# Altium project RollingBallMainBoard.PrjPcb
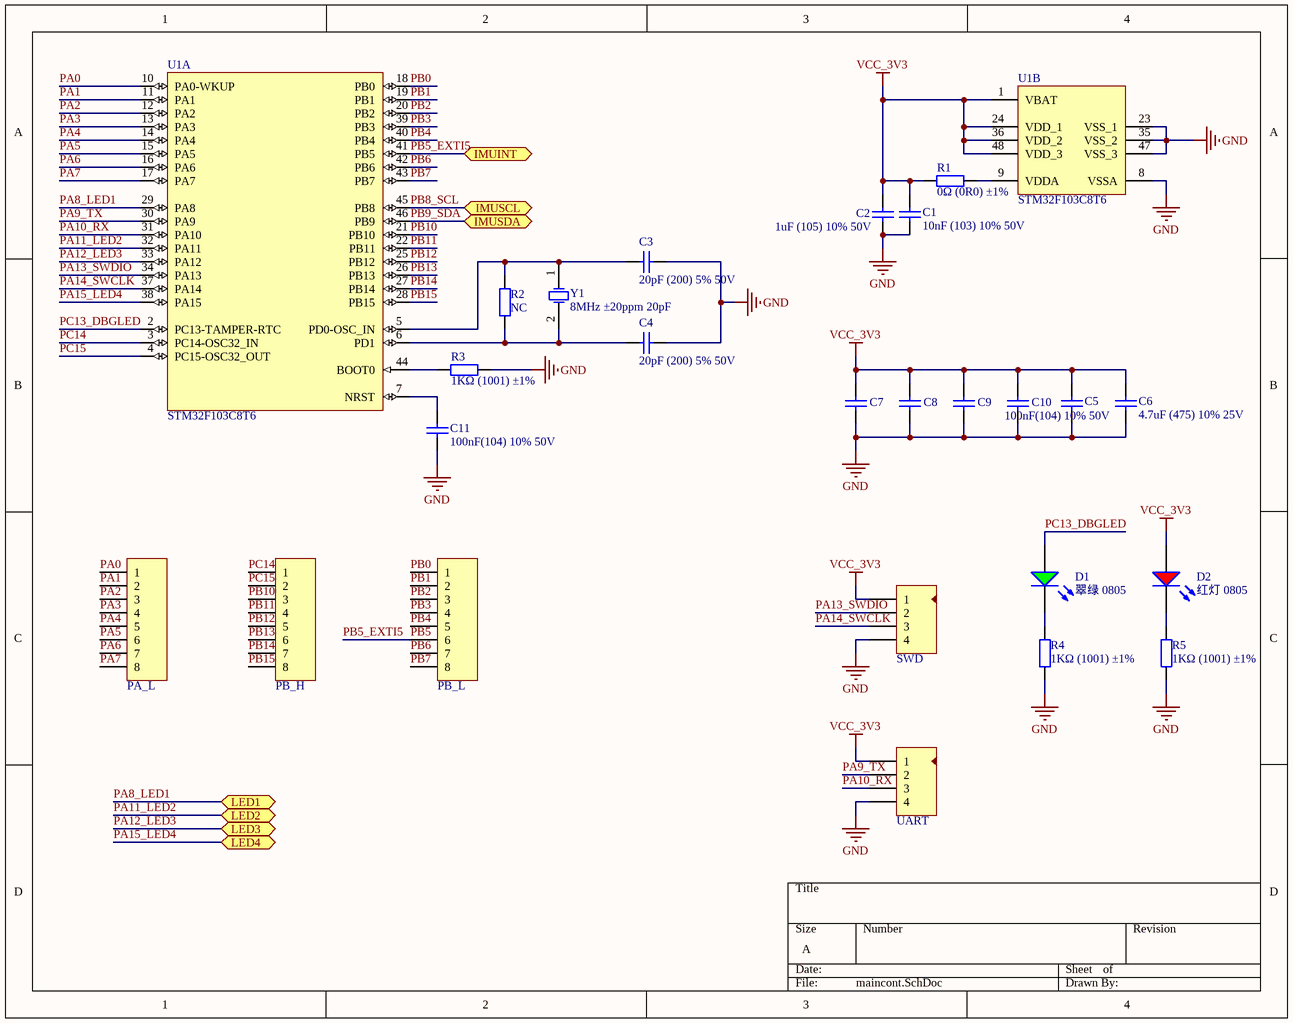
[diagram p0: maincont.SchDoc]
4 sheets, 91 parts. Net scope: flat (ports and power ports of the same name join across sheets).
Board file: RollingBall.PcbDoc
Sheets:
  maincont.SchDoc
  imu.SchDoc
  power.SchDoc
  LED.SchDoc

## Sheet maincont.SchDoc
size A

### Parts
C1  10nF (103) 10% 50V  [LC-0805_C]
C2  1uF (105) 10% 50V  [LC-0805_C]
C3  20pF (200) 5% 50V  [LC-0805_C]
C4  20pF (200) 5% 50V  [LC-0805_C]
C5  100nF(104) 10% 50V  [LC-0805_C]
C6  4.7uF (475) 10% 25V  [LC-0805_C]
C7  100nF(104) 10% 50V  [LC-0805_C]  (value not drawn)
C8  100nF(104) 10% 50V  [LC-0805_C]  (value not drawn)
C9  100nF(104) 10% 50V  [LC-0805_C]  (value not drawn)
C10  100nF(104) 10% 50V  [LC-0805_C]  (value not drawn)
C11  100nF(104) 10% 50V  [LC-0805_C]
D1  翠绿 0805  [LC-0805_LED_S1]
D2  红灯 0805  [LC-0805_LED_S1]
P1  PA_L  [HDR1X8]
P2  PB_H  [HDR1X8]
P3  PB_L  [HDR1X8]
P4  SWD  [HDR4X1-2.54]
P5  UART  [HDR4X1-2.54]
R1  0Ω (0R0) ±1%  [LC-0805_R]
R2  NC  [LC-0805_R]
R3  1KΩ (1001) ±1%  [LC-0805_R]
R4  1KΩ (1001) ±1%  [LC-0805_R]
R5  1KΩ (1001) ±1%  [LC-0805_R]
U1  STM32F103C8T6  [LC-LQFP-48_7x7x05P]  (parts A,B of 2)
Y1  8MHz ±20ppm 20pF  [LC-SMD-5032_2P]

### Ports
IMUINT, IMUSCL, IMUSDA, LED1, LED2, LED3, LED4

### Nets
GND: C1.1 C2.1 C3.2 C4.2 C5.2 C6.1 C7.2 C8.2 C9.2 C10.2 C11.1 P4.4 P5.4 R3.2 R4.1 R5.1 U1.8(VSSA) U1.23(VSS_1) U1.35(VSS_2) U1.47(VSS_3)
VCC_3V3: C1.2 C2.2 C5.1 C6.2 C7.1 C8.1 C9.1 C10.1 D2.A P4.1 P5.1 R1.2 U1.1(VBAT) U1.24(VDD_1) U1.36(VDD_2) U1.48(VDD_3)
PA0: P1.1 U1.10(PA0-WKUP)
PA1: P1.2 U1.11(PA1)
PA2: P1.3 U1.12(PA2)
PA3: P1.4 U1.13(PA3)
PA4: P1.5 U1.14(PA4)
PA5: P1.6 U1.15(PA5)
PA6: P1.7 U1.16(PA6)
PA7: P1.8 U1.17(PA7)
PA8_LED1: U1.29(PA8) ; port LED1  [project net LED_CONT1]
PA9_TX: P5.2 U1.30(PA9)
PA10_RX: P5.3 U1.31(PA10)
PA11_LED2: U1.32(PA11) ; port LED2  [project net LED_CONT2]
PA12_LED3: U1.33(PA12) ; port LED3  [project net LED_CONT3]
PA13_SWDIO: P4.2 U1.34(PA13)
PA14_SWCLK: P4.3 U1.37(PA14)
PA15_LED4: U1.38(PA15) ; port LED4  [project net LED_CONT4]
PB0: P3.1 U1.18(PB0)
PB1: P3.2 U1.19(PB1)
PB2: P3.3 U1.20(PB2)
PB3: P3.4 U1.39(PB3)
PB4: P3.5 U1.40(PB4)
PB5: P3.6 U1.41(PB5) ; port IMUINT  [also labelled PB5_EXTI5]  [project net INT]
PB6: P3.7 U1.42(PB6)
PB7: P3.8 U1.43(PB7)
PB8_SCL: U1.45(PB8) ; port IMUSCL
PB9_SDA: U1.46(PB9) ; port IMUSDA
PB10: P2.3 U1.21(PB10)
PB11: P2.4 U1.22(PB11)
PB12: P2.5 U1.25(PB12)
PB13: P2.6 U1.26(PB13)
PB14: P2.7 U1.27(PB14)
PB15: P2.8 U1.28(PB15)
PC13_DBGLED: D1.A U1.2(PC13-TAMPER-RTC)
PC14: P2.1 U1.3(PC14-OSC32_IN)
PC15: P2.2 U1.4(PC15-OSC32_OUT)
NetC3_1: C3.1 R2.1 U1.5(PD0-OSC_IN) Y1.1(OSC1)
NetC4_1: C4.1 R2.2 U1.6(PD1) Y1.2(OSC2)
NetC11_2: C11.2 U1.7(NRST)
NetD1_K: D1.K R4.2
NetD2_K: D2.K R5.2
NetR1_1: R1.1 U1.9(VDDA)
NetR3_1: R3.1 U1.44(BOOT0)

### Library data of the parts
C1 = 0805 10nF (103) 10% 50V: 贴片电容; ComponentLink1Description: 供应商链接; ComponentLink1URL: http://www.szlcsc.com/product/details_2062.html; Package: 0805; Supplier: LC; SuppliersPartNumber: C1710
C2 = 0805 1uF (105) 10% 50V: 贴片电容; ComponentLink1Description: 供应商链接; ComponentLink1URL: http://www.szlcsc.com/product/details_29074.html; Package: 0805; Supplier: LC; SuppliersPartNumber: C28323
C3 C4 = 0805 20pF (200) 5% 50V: 贴片电容; ComponentLink1Description: 供应商链接; ComponentLink1URL: http://www.szlcsc.com/product/details_2150.html; Package: 0805; Supplier: LC; SuppliersPartNumber: C1798
C5 C7-C11 = 0805 100nF(104) 10% 50V: 贴片电容; ComponentLink1Description: 供应商链接; ComponentLink1URL: http://www.szlcsc.com/product/details_50686.html; Package: 0805; Supplier: LC; SuppliersPartNumber: C49678
C6 = 0805 4.7uF (475) 10% 25V: 贴片电容; ComponentLink1Description: 供应商链接; ComponentLink1URL: http://www.szlcsc.com/product/details_2131.html; Package: 0805; Supplier: LC; SuppliersPartNumber: C1779
D1 = 0805 翠绿: 发光二极管; ComponentLink1Description: 供应商链接; ComponentLink1URL: http://www.szlcsc.com/product/details_2670.html; Package: 0805; Supplier: LC; SuppliersPartNumber: C2297
D2 = 0805 红灯: 发光二极管; ComponentLink1Description: 供应商链接; ComponentLink1URL: http://www.szlcsc.com/product/details_2668.html; Package: 0805; Supplier: LC; SuppliersPartNumber: C2295
P1-P3 = Header 8: Header, 8-Pin; LatestRevisionDate: 17-Jul-2002; LatestRevisionNote: Re-released for DXP Platform.; Publisher: Altium Limited
P4 P5 = Header 4: 接插件; LatestRevisionDate: 17-Jul-2002; LatestRevisionNote: Re-released for DXP Platform.; Publisher: Altium Limited
R1 = 0805 0Ω (0R0) 1%: 贴片电阻; ComponentLink1Description: 供应商链接; ComponentLink1URL: http://www.szlcsc.com/product/details_18165.html; Package: 0805; Supplier: LC; SuppliersPartNumber: C17477
R2 = 0805 1MΩ (1004) 1%: 贴片电阻; ComponentLink1Description: 供应商链接; ComponentLink1URL: http://www.szlcsc.com/product/details_18202.html; Package: 0805; Supplier: LC; SuppliersPartNumber: C17514
R3-R5 = 0805 1KΩ (1001) 1%: 贴片电阻; ComponentLink1Description: 供应商链接; ComponentLink1URL: http://www.szlcsc.com/product/details_18201.html; Package: 0805; Supplier: LC; SuppliersPartNumber: C17513
U1 = STM32F103C8T6: ARM; ComponentLink1Description: 供应商链接; ComponentLink1URL: http://www.szlcsc.com/product/details_9243.html; Package: LQFP-48_7x7x05P; Supplier: LC; SuppliersPartNumber: C8734
Y1 = SMD-5032_2P 8MHz 20ppm 20pF: 贴片晶振; ComponentLink1Description: 供应商链接; ComponentLink1URL: http://www.szlcsc.com/product/details_19261.html; Package: SMD-5032_2P; Supplier: LC; SuppliersPartNumber: C18560

## Sheet imu.SchDoc
size A
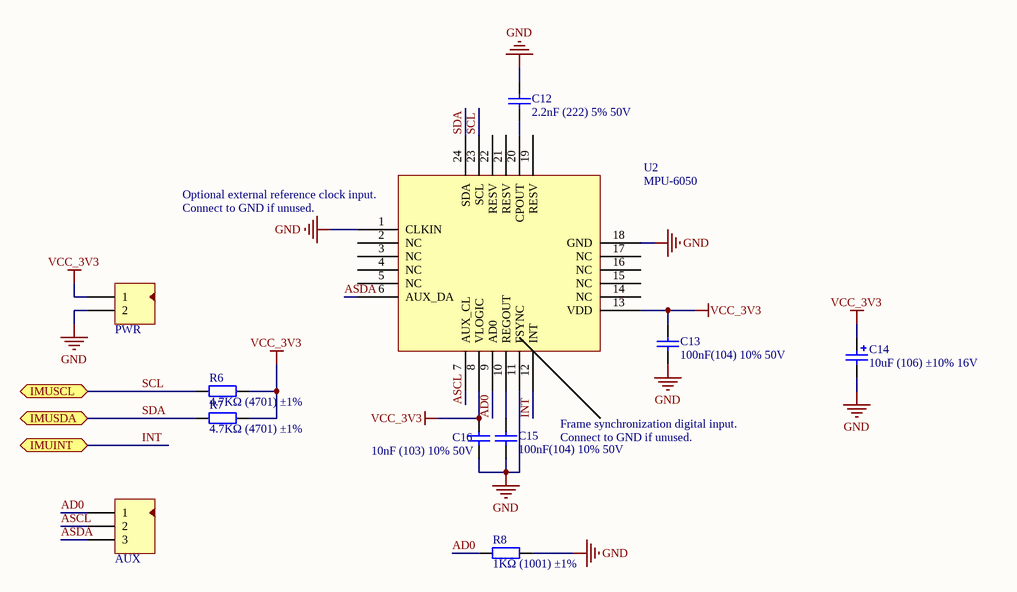
[diagram p1: imu.SchDoc]

### Parts
C12  2.2nF (222) 5% 50V  [LC-0805_C]
C13  100nF(104) 10% 50V  [LC-0805_C]
C14  10uF (106) ±10% 16V  [LC-CASE-A_3216]
C15  100nF(104) 10% 50V  [LC-0805_C]
C16  10nF (103) 10% 50V  [LC-0805_C]
P6  PWR  [HDR2X1-2.54]
P7  AUX  [HDR3X1-2.54]
R6  4.7KΩ (4701) ±1%  [LC-0805_R]
R7  4.7KΩ (4701) ±1%  [LC-0805_R]
R8  1KΩ (1001) ±1%  [LC-0805_R]
U2  MPU-6050  [LC-QFN-24_4x4x05P]

### Ports
IMUINT, IMUSCL, IMUSDA

### Nets
GND: C12.2 C13.1 C14.2 C15.2 C16.1 P6.2 R8.2 U2.1(CLKIN) U2.11(FSYNC) U2.18(GND)
VCC_3V3: C13.2 C14.1 C16.2 P6.1 R6.2 R7.2 U2.8(VLOGIC) U2.13(VDD)
AD0: P7.1 R8.1 U2.9(AD0)
ASCL: P7.2 U2.7(AUX_CL)
ASDA: P7.3 U2.6(AUX_DA)
INT: U2.12(INT) ; port IMUINT
SCL: R6.1 U2.23(SCL) ; port IMUSCL  [project net PB8_SCL]
SDA: R7.1 U2.24(SDA) ; port IMUSDA  [project net PB9_SDA]
NetC12_1: C12.1 U2.20(CPOUT)
NetC15_1: C15.1 U2.10(REGOUT)

Not connected (* = marked no-connect by the designer): U2 2(NC) 3(NC) 4(NC) 5(NC) 14(NC) 15(NC) 16(NC) 17(NC) 19(RESV) 21(RESV) 22(RESV)

### Notes on the sheet
- (near U2) Optional external reference clock input.
- Connect to GND if unused.
- Frame synchronization digital input.

### Library data of the parts
C12 = 0805 2.2nF (222) 5% 50V: 贴片电容; ComponentLink1Description: 供应商链接; ComponentLink1URL: http://www.szlcsc.com/product/details_29010.html; Package: 0805; Supplier: LC; SuppliersPartNumber: C28260
C13 C15 = 0805 100nF(104) 10% 50V: 贴片电容; ComponentLink1Description: 供应商链接; ComponentLink1URL: http://www.szlcsc.com/product/details_50686.html; Package: 0805; Supplier: LC; SuppliersPartNumber: C49678
C14 = 3216 10uF (106) 10% 16V: 钽电容; ComponentLink1Description: 供应商链接; ComponentLink1URL: http://www.szlcsc.com/product/details_7643.html; Package: 3216; Supplier: LC; SuppliersPartNumber: C7171
C16 = 0805 10nF (103) 10% 50V: 贴片电容; ComponentLink1Description: 供应商链接; ComponentLink1URL: http://www.szlcsc.com/product/details_2062.html; Package: 0805; Supplier: LC; SuppliersPartNumber: C1710
P6 = Header 2: 接插件; LatestRevisionDate: 17-Jul-2002; LatestRevisionNote: Re-released for DXP Platform.; Publisher: Altium Limited
P7 = Header 3: 接插件; LatestRevisionDate: 17-Jul-2002; LatestRevisionNote: Re-released for DXP Platform.; Publisher: Altium Limited
R6 R7 = 0805 4.7KΩ (4701) 1%: 贴片电阻; ComponentLink1Description: 供应商链接; ComponentLink1URL: http://www.szlcsc.com/product/details_18361.html; Package: 0805; Supplier: LC; SuppliersPartNumber: C17673
R8 = 0805 1KΩ (1001) 1%: 贴片电阻; ComponentLink1Description: 供应商链接; ComponentLink1URL: http://www.szlcsc.com/product/details_18201.html; Package: 0805; Supplier: LC; SuppliersPartNumber: C17513
U2 = MPU-6050: 传感器; ComponentLink1Description: 供应商链接; ComponentLink1URL: http://www.szlcsc.com/product/details_24852.html; Package: QFN-24_4x4x05P; Supplier: LC; SuppliersPartNumber: C24112

## Sheet power.SchDoc
size A
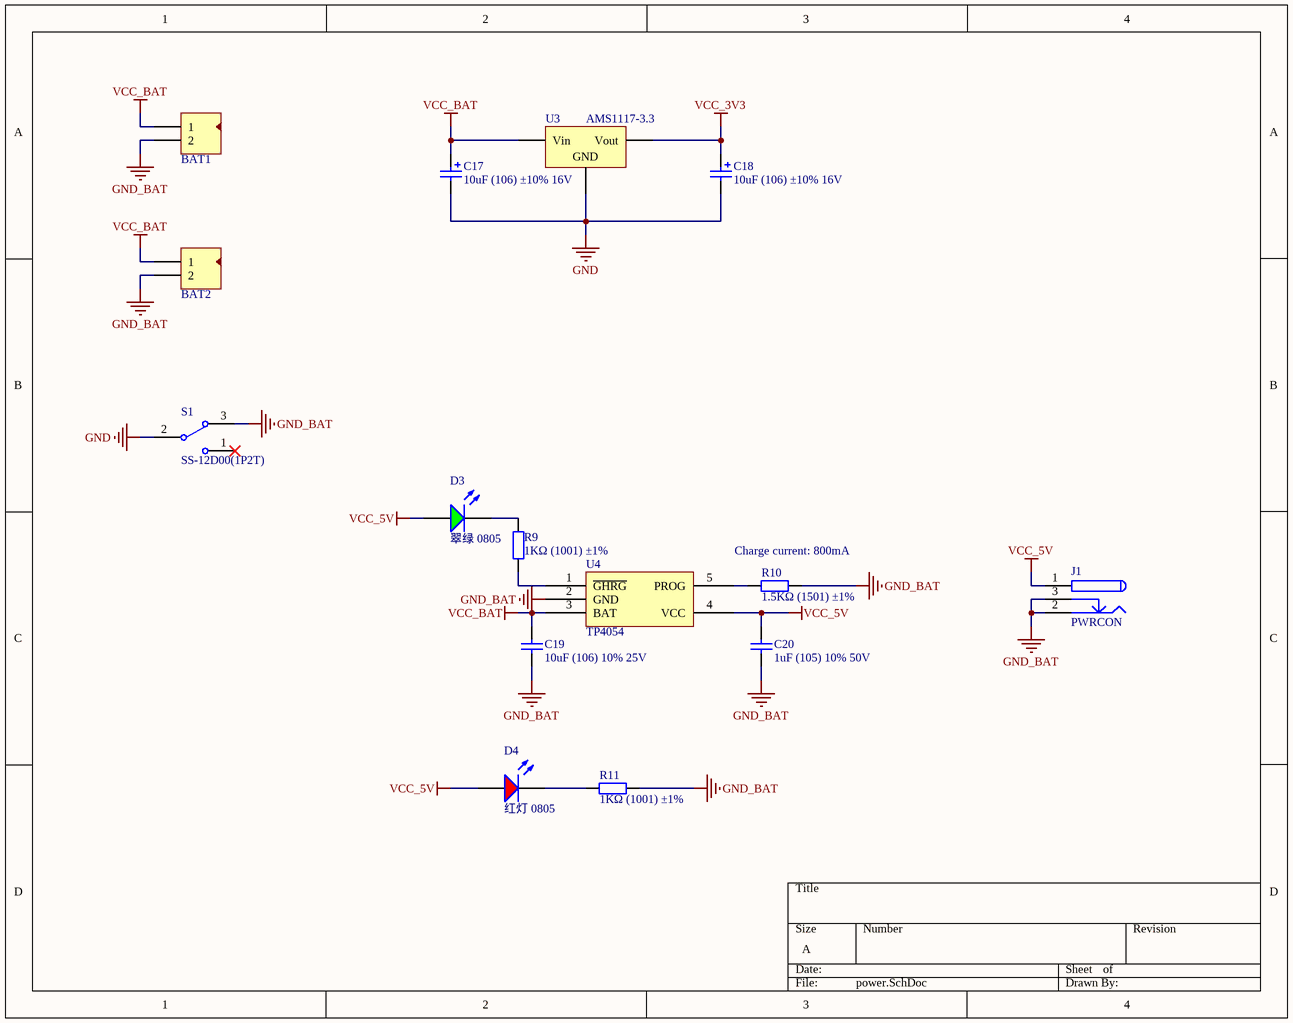
[diagram p2: power.SchDoc]

### Parts
C17  10uF (106) ±10% 16V  [LC-CASE-A_3216]
C18  10uF (106) ±10% 16V  [LC-CASE-A_3216]
C19  10uF (106) 10% 25V  [LC-0805_C]
C20  1uF (105) 10% 50V  [LC-0805_C]
D3  翠绿 0805  [LC-0805_LED_S1]
D4  红灯 0805  [LC-0805_LED_S1]
J1  PWRCON  [DC-005]
P8  BAT1  [HDR2X1-2.54]
P9  BAT2  [HDR2X1-2.54]
R9  1KΩ (1001) ±1%  [LC-0805_R]
R10  1.5KΩ (1501) ±1%  [LC-0805_R]
R11  1KΩ (1001) ±1%  [LC-0805_R]
S1  SS-12D00(1P2T)  [XH2.54-3P]
U3  AMS1117-3.3  [LC-SOT-223]
U4  TP4054  [LC-SOT-23-5]

### Nets
GND: C17.2 C18.2 S1.2 U3.1(GND)
GND_BAT: C19.1 C20.1 J1.2 J1.3 P8.2 P9.2 R10.2 R11.1 S1.3 U4.2(GND)
VCC_3V3: C18.1 U3.2(Vout)
VCC_5V: C20.2 D3.A D4.A J1.1 U4.4(VCC)
VCC_BAT: C17.1 C19.2 P8.1 P9.1 U3.3(Vin) U4.3(BAT)
NetD3_K: D3.K R9.2
NetD4_K: D4.K R11.2
NetR9_1: R9.1 U4.1(~{GHRG})
NetR10_1: R10.1 U4.5(PROG)

Not connected (* = marked no-connect by the designer): S1 1*

### Notes on the sheet
- (near R10) Charge current: 800mA

### Library data of the parts
C17 C18 = 3216 10uF (106) 10% 16V: 钽电容; ComponentLink1Description: 供应商链接; ComponentLink1URL: http://www.szlcsc.com/product/details_7643.html; Package: 3216; Supplier: LC; SuppliersPartNumber: C7171
C19 = 0805 10uF (106) 10% 25V: 贴片电容; ComponentLink1Description: 供应商链接; ComponentLink1URL: http://www.szlcsc.com/product/details_16532.html; Package: 0805; Supplier: LC; SuppliersPartNumber: C15850
C20 = 0805 1uF (105) 10% 50V: 贴片电容; ComponentLink1Description: 供应商链接; ComponentLink1URL: http://www.szlcsc.com/product/details_29074.html; Package: 0805; Supplier: LC; SuppliersPartNumber: C28323
D3 = 0805 翠绿: 发光二极管; ComponentLink1Description: 供应商链接; ComponentLink1URL: http://www.szlcsc.com/product/details_2670.html; Package: 0805; Supplier: LC; SuppliersPartNumber: C2297
D4 = 0805 红灯: 发光二极管; ComponentLink1Description: 供应商链接; ComponentLink1URL: http://www.szlcsc.com/product/details_2668.html; Package: 0805; Supplier: LC; SuppliersPartNumber: C2295
J1 = PWRCON: 直流电源端子; Published: 17-Dec-2003; DatasheetDocument: 09-May-2002; Publisher: Altium Limited; ComponentLink1Description: Manufacturer Link; ComponentLink1URL: http://domino.kycon.com/internet/Products.html
P8 P9 = Header 2: 接插件; LatestRevisionDate: 17-Jul-2002; LatestRevisionNote: Re-released for DXP Platform.; Publisher: Altium Limited
R9 R11 = 0805 1KΩ (1001) 1%: 贴片电阻; ComponentLink1Description: 供应商链接; ComponentLink1URL: http://www.szlcsc.com/product/details_18201.html; Package: 0805; Supplier: LC; SuppliersPartNumber: C17513
R10 = 0805 1.5KΩ (1501) 1%: 贴片电阻; ComponentLink1Description: 供应商链接; ComponentLink1URL: http://www.szlcsc.com/product/details_4717.html; Package: 0805; Supplier: LC; SuppliersPartNumber: C4310
S1 = SW-SPDT: 开关; Published: 24-Mar-1999; LatestRevisionDate: 17-Dec-2003; LatestRevisionNote: Schematic revised, PCB Footprint replaced.; DatasheetDocument: 05-Dec-2000; PackageReference: TL36WW15050; Publisher: Altium Limited; ComponentLink1Description: Manufacturer Link; ComponentLink1URL: http://www.apem.com
U3 = SOT-223 AMS1117-3.3: 低压差线性稳压(LDO); ComponentLink1Description: 供应商链接; ComponentLink1URL: http://www.szlcsc.com/product/details_6652.html; Package: SOT-223; Supplier: LC; SuppliersPartNumber: C6186
U4 = TP4054: 电池电源管理; ComponentLink1Description: 供应商链接; ComponentLink1URL: http://www.szlcsc.com/product/details_33539.html; Package: SOT-23-5; Supplier: LC; SuppliersPartNumber: C32574

## Sheet LED.SchDoc
size A
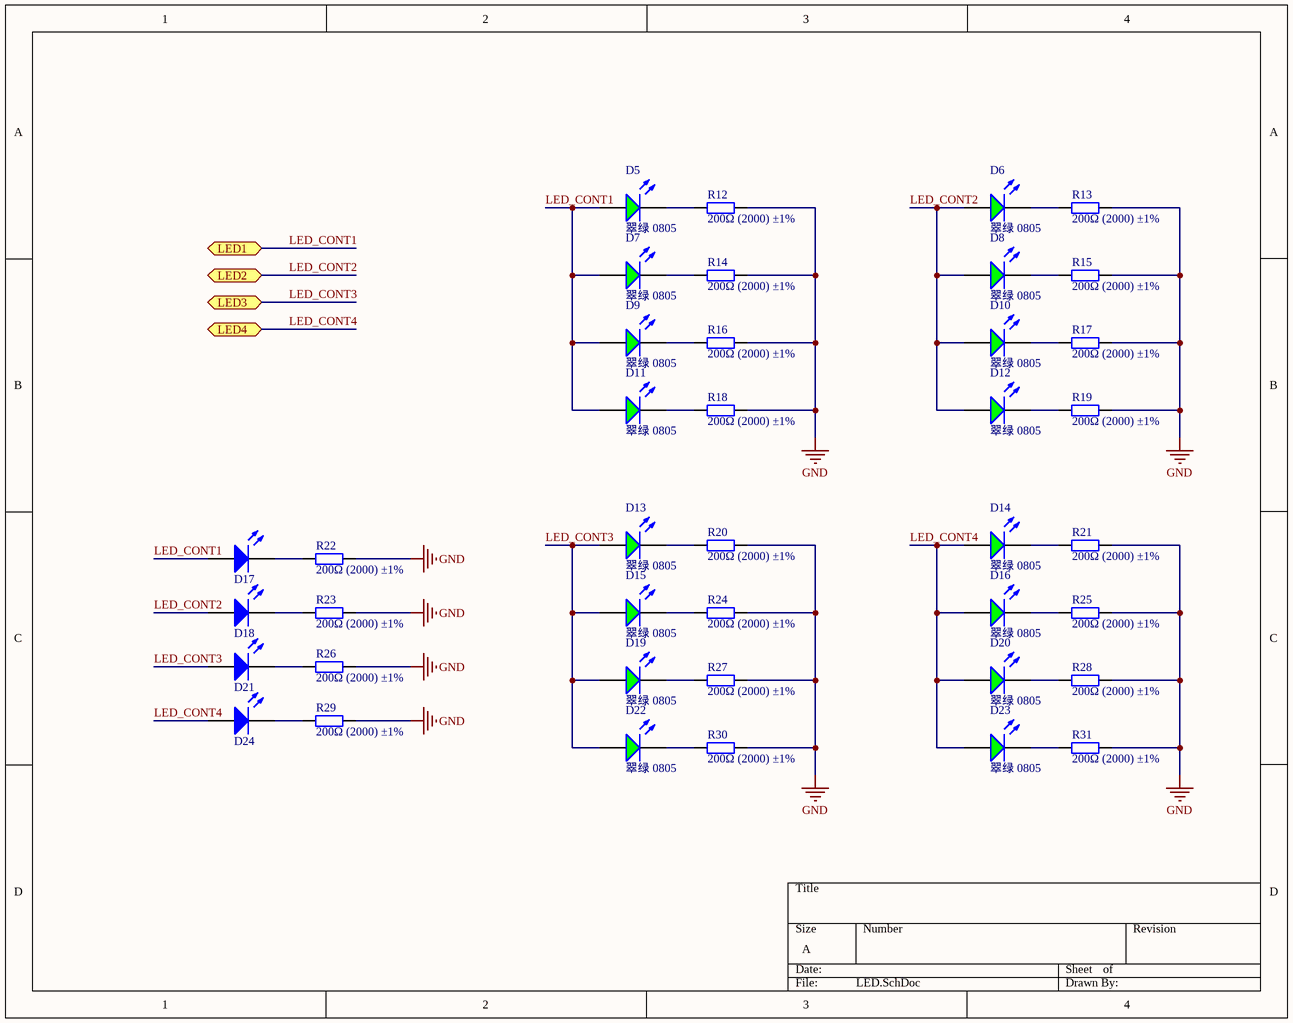
[diagram p3: LED.SchDoc]

### Parts
D5  翠绿 0805  [LC-0805_LED_S1]
D6  翠绿 0805  [LC-0805_LED_S1]
D7  翠绿 0805  [LC-0805_LED_S1]
D8  翠绿 0805  [LC-0805_LED_S1]
D9  翠绿 0805  [LC-0805_LED_S1]
D10  翠绿 0805  [LC-0805_LED_S1]
D11  翠绿 0805  [LC-0805_LED_S1]
D12  翠绿 0805  [LC-0805_LED_S1]
D13  翠绿 0805  [LC-0805_LED_S1]
D14  翠绿 0805  [LC-0805_LED_S1]
D15  翠绿 0805  [LC-0805_LED_S1]
D16  翠绿 0805  [LC-0805_LED_S1]
D17  LED0  [LED_A2]  (value not drawn)
D18  LED0  [LED_A2]  (value not drawn)
D19  翠绿 0805  [LC-0805_LED_S1]
D20  翠绿 0805  [LC-0805_LED_S1]
D21  LED0  [LED_A2]  (value not drawn)
D22  翠绿 0805  [LC-0805_LED_S1]
D23  翠绿 0805  [LC-0805_LED_S1]
D24  LED0  [LED_A2]  (value not drawn)
R12  200Ω (2000) ±1%  [LC-0805_R]
R13  200Ω (2000) ±1%  [LC-0805_R]
R14  200Ω (2000) ±1%  [LC-0805_R]
R15  200Ω (2000) ±1%  [LC-0805_R]
R16  200Ω (2000) ±1%  [LC-0805_R]
R17  200Ω (2000) ±1%  [LC-0805_R]
R18  200Ω (2000) ±1%  [LC-0805_R]
R19  200Ω (2000) ±1%  [LC-0805_R]
R20  200Ω (2000) ±1%  [LC-0805_R]
R21  200Ω (2000) ±1%  [LC-0805_R]
R22  200Ω (2000) ±1%  [LC-0805_R]
R23  200Ω (2000) ±1%  [LC-0805_R]
R24  200Ω (2000) ±1%  [LC-0805_R]
R25  200Ω (2000) ±1%  [LC-0805_R]
R26  200Ω (2000) ±1%  [LC-0805_R]
R27  200Ω (2000) ±1%  [LC-0805_R]
R28  200Ω (2000) ±1%  [LC-0805_R]
R29  200Ω (2000) ±1%  [LC-0805_R]
R30  200Ω (2000) ±1%  [LC-0805_R]
R31  200Ω (2000) ±1%  [LC-0805_R]

### Ports
LED1, LED2, LED3, LED4

### Nets
GND: R12.2 R13.2 R14.2 R15.2 R16.2 R17.2 R18.2 R19.2 R20.2 R21.2 R22.2 R23.2 R24.2 R25.2 R26.2 R27.2 R28.2 R29.2 R30.2 R31.2
LED_CONT1: D5.A D7.A D9.A D11.A D17.1(A) ; port LED1
LED_CONT2: D6.A D8.A D10.A D12.A D18.1(A) ; port LED2
LED_CONT3: D13.A D15.A D19.A D21.1(A) D22.A ; port LED3
LED_CONT4: D14.A D16.A D20.A D23.A D24.1(A) ; port LED4
NetD5_K: D5.K R12.1
NetD6_K: D6.K R13.1
NetD7_K: D7.K R14.1
NetD8_K: D8.K R15.1
NetD9_K: D9.K R16.1
NetD10_K: D10.K R17.1
NetD11_K: D11.K R18.1
NetD12_K: D12.K R19.1
NetD13_K: D13.K R20.1
NetD14_K: D14.K R21.1
NetD15_K: D15.K R24.1
NetD16_K: D16.K R25.1
NetD17_2: D17.2(K) R22.1
NetD18_2: D18.2(K) R23.1
NetD19_K: D19.K R27.1
NetD20_K: D20.K R28.1
NetD21_2: D21.2(K) R26.1
NetD22_K: D22.K R30.1
NetD23_K: D23.K R31.1
NetD24_2: D24.2(K) R29.1

### Library data of the parts
D5-D16 D19 D20 D22 D23 = 0805 翠绿: 发光二极管; ComponentLink1Description: 供应商链接; ComponentLink1URL: http://www.szlcsc.com/product/details_2670.html; Package: 0805; Supplier: LC; SuppliersPartNumber: C2297
D17 D18 D21 D24 = LED0: 发光二极管; Published: 8-Jun-2000; LatestRevisionDate: 08-Jul-2005; LatestRevisionNote: Mech Layer 1 removed.; PackageReference: LED-0; Publisher: Altium Limited
R12-R31 = 0805 200Ω (2000) 1%: 贴片电阻; ComponentLink1Description: 供应商链接; ComponentLink1URL: http://www.szlcsc.com/product/details_18228.html; Package: 0805; Supplier: LC; SuppliersPartNumber: C17540

## Nets that join several sheets
GND: maincont (20 pins), imu (10 pins), power (C17.2 C18.2 S1.2 U3.1), LED (20 pins)
VCC_3V3: maincont (16 pins), imu (8 pins), power (C18.1 U3.2)
INT: maincont (P3.6 U1.41), imu (U2.12)
LED_CONT1: maincont (U1.29), LED (5 pins)
LED_CONT2: maincont (U1.32), LED (5 pins)
LED_CONT3: maincont (U1.33), LED (5 pins)
LED_CONT4: maincont (U1.38), LED (5 pins)
PB8_SCL: maincont (U1.45), imu (R6.1 U2.23)
PB9_SDA: maincont (U1.46), imu (R7.1 U2.24)